# Altium schematic sheet DCSource6V0.SchDoc
size A4; DocumentNumber: 4; SheetNumber: 4; SheetTotal: 5
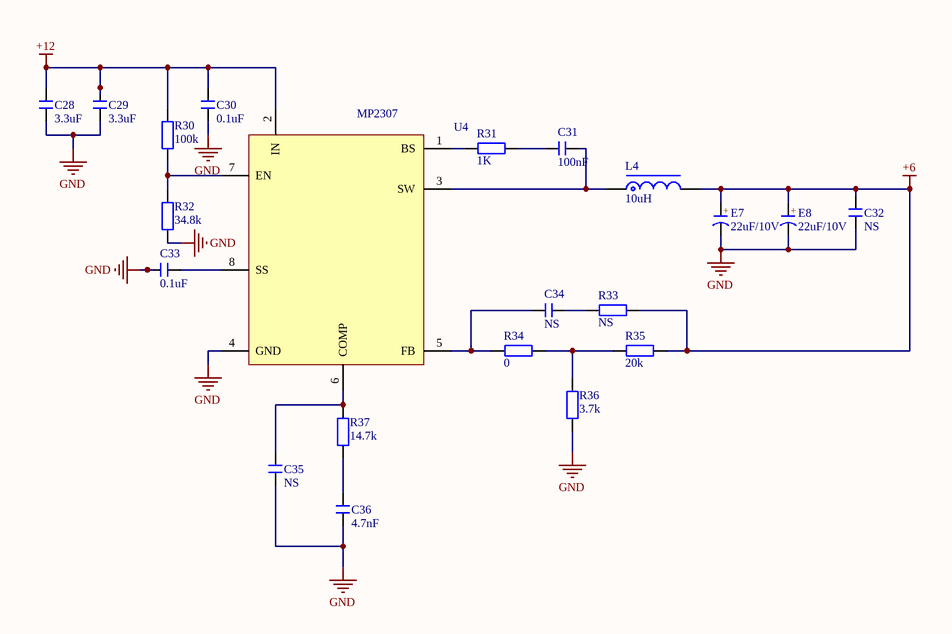
[diagram p0: DCSource6V0.SchDoc]

## Parts
C28  3.3uF  [C 0805_L]
C29  3.3uF  [C 0805_L]
C30  0.1uF  [C 0805_L]
C31  100nF  [C 0805_L]
C32  NS  [C 0805_L]
C33  0.1uF  [C 0805_L]
C34  NS  [C 0805_L]
C35  NS  [C 0805_L]
C36  4.7nF  [C 0805_L]
E7  22uF/10V  [CT 5*6 - C]
E8  22uF/10V  [CT 5*6 - C]
L4  10uH  [CD31]
R30  100k  [R 0805_L]
R31  1K  [R 0805_L]
R32  34.8k  [R 0805_L]
R33  NS  [R 0805_L]
R34  0  [R 0805_L]
R35  20k  [R 0805_L]
R36  3.7k  [R 0805_L]
R37  14.7k  [R 0805_L]
U4  MP2307  [SOP8_M]

## Nets
+6: C32.2 E7.1(A) E8.1(A) L4.2 R33.1 R35.2
+12: C28.2 C29.2 C30.2 R30.2 U4.2(IN)
GND: C28.1 C29.1 C30.1 C32.1 C33.2 C35.1 C36.1 E7.2(K) E8.2(K) R32.1 R36.1 U4.4(GND)
NetC31_1: C31.1 R31.2
NetC31_2: C31.2 L4.1 U4.3(SW)
NetC33_1: C33.1 U4.8(SS)
NetC34_1: C34.1 R34.1 U4.5(FB)
NetC34_2: C34.2 R33.2
NetC35_2: C35.2 R37.2 U4.6(COMP)
NetC36_2: C36.2 R37.1
NetR30_1: R30.1 R32.2 U4.7(EN)
NetR31_1: R31.1 U4.1(BS)
NetR34_2: R34.2 R35.1 R36.2

## Notes on the sheet
- (in symbol C-CT) +

## Library data of the parts
C28-C36 = C: 无极性贴片电容; 材质: X7R; BOM名称: 无极性贴片电容
E7 E8 = C-CT: 贴片固态电容; BOM名称: 贴片固态电容
L4 = L-CD: 贴片功率电感; BOM名称: 功率电感
R30-R37 = R: 贴片电阻; BOM名称: 贴片电阻
U4 = Component_1